# Altium schematic sheet Fuentes.SchDoc
size A4
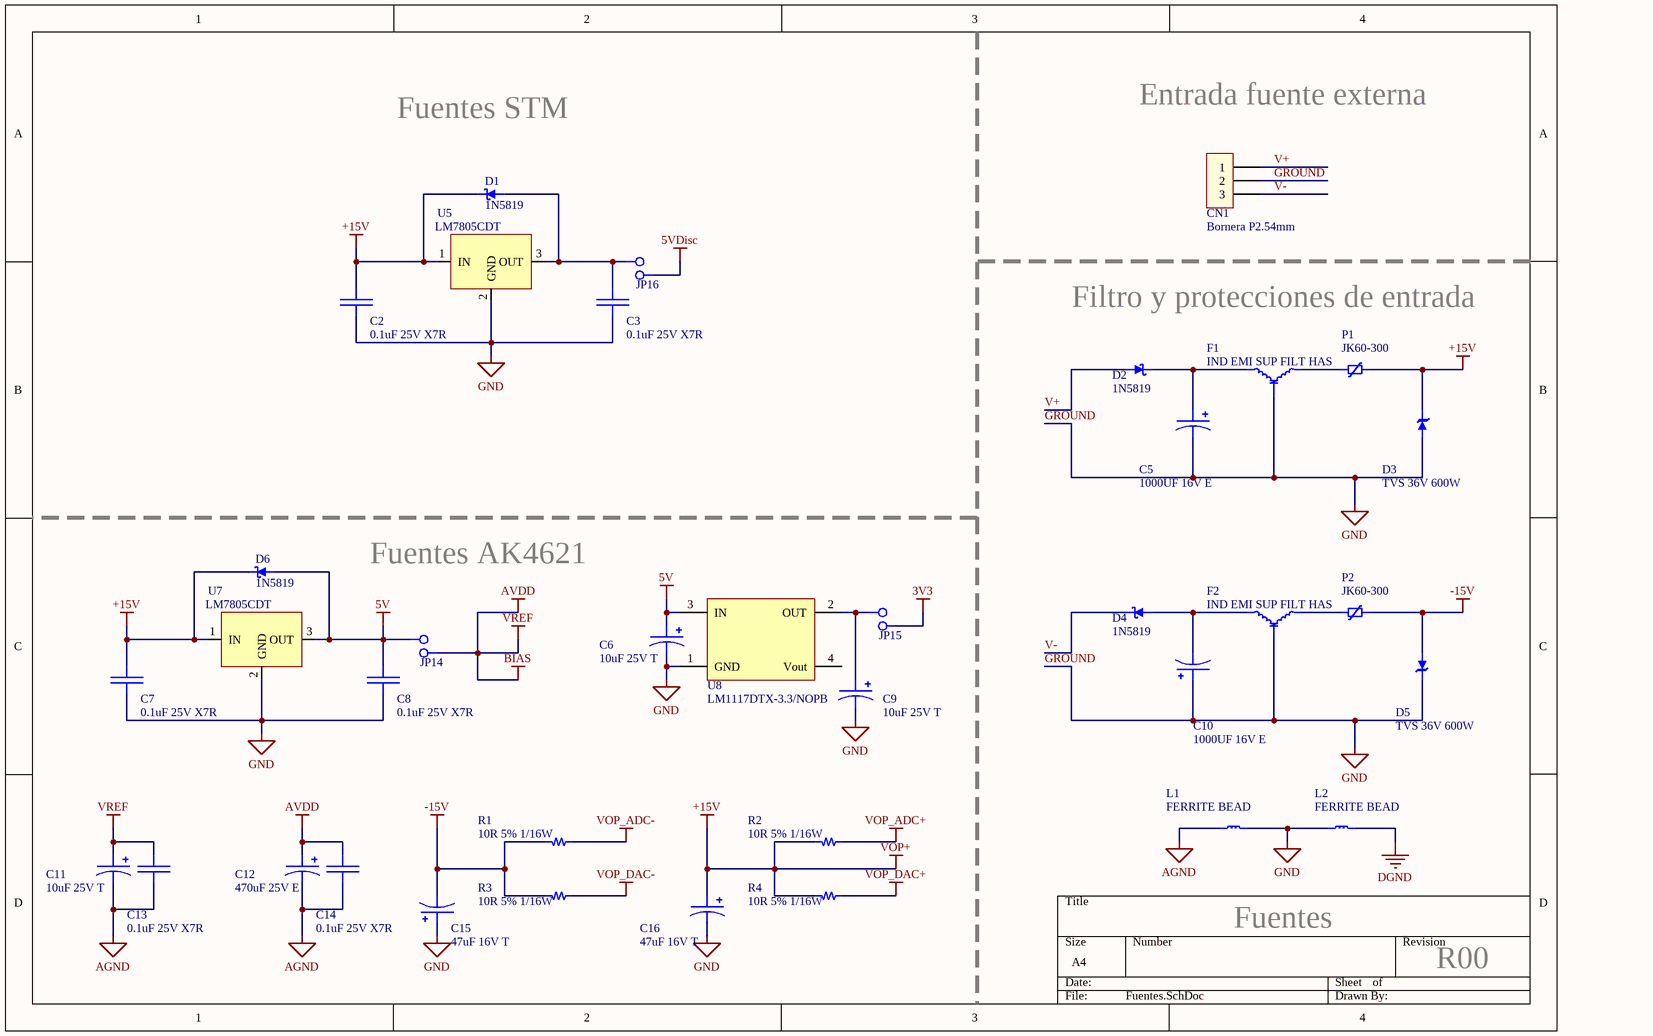
[diagram p0: Fuentes.SchDoc]

## Parts
C2  0.1uF 25V X7R  [C_0805]
C3  0.1uF 25V X7R  [C_0805]
C5  1000UF 16V E  [Capael_10x16 RAD]
C6  10uF 25V T  [TANT]
C7  0.1uF 25V X7R  [C_0805]
C8  0.1uF 25V X7R  [C_0805]
C9  10uF 25V T  [TANT]
C10  1000UF 16V E  [Capael_10x16 RAD]
C11  10uF 25V T  [TANT]
C12  470uF 25V E  [Capael_8x12 RAD]
C13  0.1uF 25V X7R  [C_0805]
C14  0.1uF 25V X7R  [C_0805]
C15  47uF 16V T  [TANT]
C16  47uF 16V T  [TANT]
CN1  Bornera P2.54mm  [Conn_3_1]
D1  1N5819  [59-04]
D2  1N5819  [59-04]
D3  TVS 36V 600W  [59-04]
D4  1N5819  [59-04]
D5  TVS 36V 600W  [59-04]
D6  1N5819  [59-04]
F1  IND EMI SUP FILT HAS  [EMIFIL_DSS6_S]
F2  IND EMI SUP FILT HAS  [EMIFIL_DSS6_S]
JP14  Jumper 2x1  [Conn_2_1]  (value not drawn)
JP15  Jumper 2x1  [Conn_2_1]  (value not drawn)
JP16  Jumper 2x1  [Conn_2_1]  (value not drawn)
L1  FERRITE BEAD  [EC22/KC204]
L2  FERRITE BEAD  [EC22/KC204]
P1  JK60-300  [JK60-300]
P2  JK60-300  [JK60-300]
R1  10R 5% 1/16W  [R_0805]
R2  10R 5% 1/16W  [R_0805]
R3  10R 5% 1/16W  [R_0805]
R4  10R 5% 1/16W  [R_0805]
U5  LM7805CDT  [TO-220-3]
U7  LM7805CDT  [TO-220-3]
U8  LM1117DTX-3.3/NOPB  [DPAK]

## Nets
3V3: JP15.2
5V: C6.1 C8.1 D6.1(|) JP14.1 U7.3(OUT) U8.3(IN)
5VDisc: JP16.2
+15V: C2.1 C7.1 C16.1 D1.2 D3.2 D6.2 P1.2 R2.2 R4.2 U5.1(IN) U7.1(IN)  [also labelled VOP+]
-15V: C15.2 D5.1(|) P2.2 R1.2 R3.2
AGND: C11.2 C12.2 C13.2 C14.2 L1.1
AVDD: C11.1 C12.1 C13.1 C14.1 JP14.2  [also labelled BIAS, VREF]
DGND: L2.2
GROUND: C2.2 C3.2 C5.2 C6.2 C7.2 C8.2 C9.2 C10.1 C15.1 C16.2 CN1.2 D3.1(|) D5.2 F1.2 F2.2 L1.2 L2.1 U5.2(GND) U7.2(GND) U8.1(GND)  [also labelled GND]
VOP_ADC+: R2.1
VOP_ADC-: R1.1
VOP_DAC+: R4.1
VOP_DAC-: R3.1
V+: CN1.1 D2.1(|)
V-: CN1.3 D4.2
NetC3_1: C3.1 D1.1(|) JP16.1 U5.3(OUT)
NetC5_1: C5.1 D2.2 F1.1
NetC9_1: C9.1 JP15.1 U8.2(OUT)
NetC10_2: C10.2 D4.1(|) F2.1
NetF1_3: F1.3 P1.1
NetF2_3: F2.3 P2.1

Not connected (* = marked no-connect by the designer): U8 4(Vout)

## Notes on the sheet
- Entrada fuente externa
- Fuentes STM
- Filtro y protecciones de entrada
- Fuentes AK4621
- Fuentes
- R00

## Library data of the parts
C2 C3 C7 C8 C13 C14 = Capacitor: Capacitor de placas paralelas; Cod. Proveedor: CA3289100; Encapsulado: 0603; Proveedor: Elemon
C5 C10 = CapaPol: Capacitor polarizado; Cod. Proveedor: CA3609183; Proveedor: Elemon; Encapsulado: TH-10x16
C6 C9 C11 C12 C15 C16 = CapaPol: Capacitor polarizado; Encapsulado: TH; Cod. Proveedor: -; Proveedor: -
CN1 = Conn_3_1: Conector de 3 pines en hilera
D1 D2 D4 D6 = Schottky: Diodo Schottky; Encapsulado: TH; Cod. Proveedor: -; Proveedor: -
D3 D5 = TVS: Diodo TVS; Cod. Proveedor: DI120SMDDIK36AT3G; Proveedor: Elemon; Encapsulado: SMB
F1 = EMI_3T: Filtro EMI 3 terminales; Cod. Proveedor: FI151VINBOB600; Proveedor: Elemon; Encapsulado: DSS6_S; Otro del mismo proveedor: FI1521500
F2 = EMI_3T: Filtro EMI 3 terminales; Cod. Proveedor: FI151VINBOB600; Proveedor: Elemon; Encapsulado: DSS6_S
L1 L2 = Inductor: Encapsulado: TH; Cod. Proveedor: -; Proveedor: -
P1 P2 = Poly: Cod. Proveedor: TE2627680; Proveedor: Elemon; Encapsulado: TH
R1-R4 = Resistor: Resistencia; Cod. Proveedor: RS3866060; Encapsulado: 0603; Proveedor: Elemon
U5 U7 = LM7805: Regulador lineal 5V; Cod. Proveedor: CI2707459; Proveedor: Elemon; Encapsulado: TO-220-3
U8 = LM1117: Regulador Switching; Cod. Proveedor: CI2707214D; Proveedor: Elemon; Encapsulado: DPAK